# EasyEDA schematic PCB10.1_PRABHU.json
TITLE: Sheet_1; REV: 1.0; Date: 2021-05-30; Sheet: 1/1; Drawn By: Prabhu Sharma; Company: Your Company
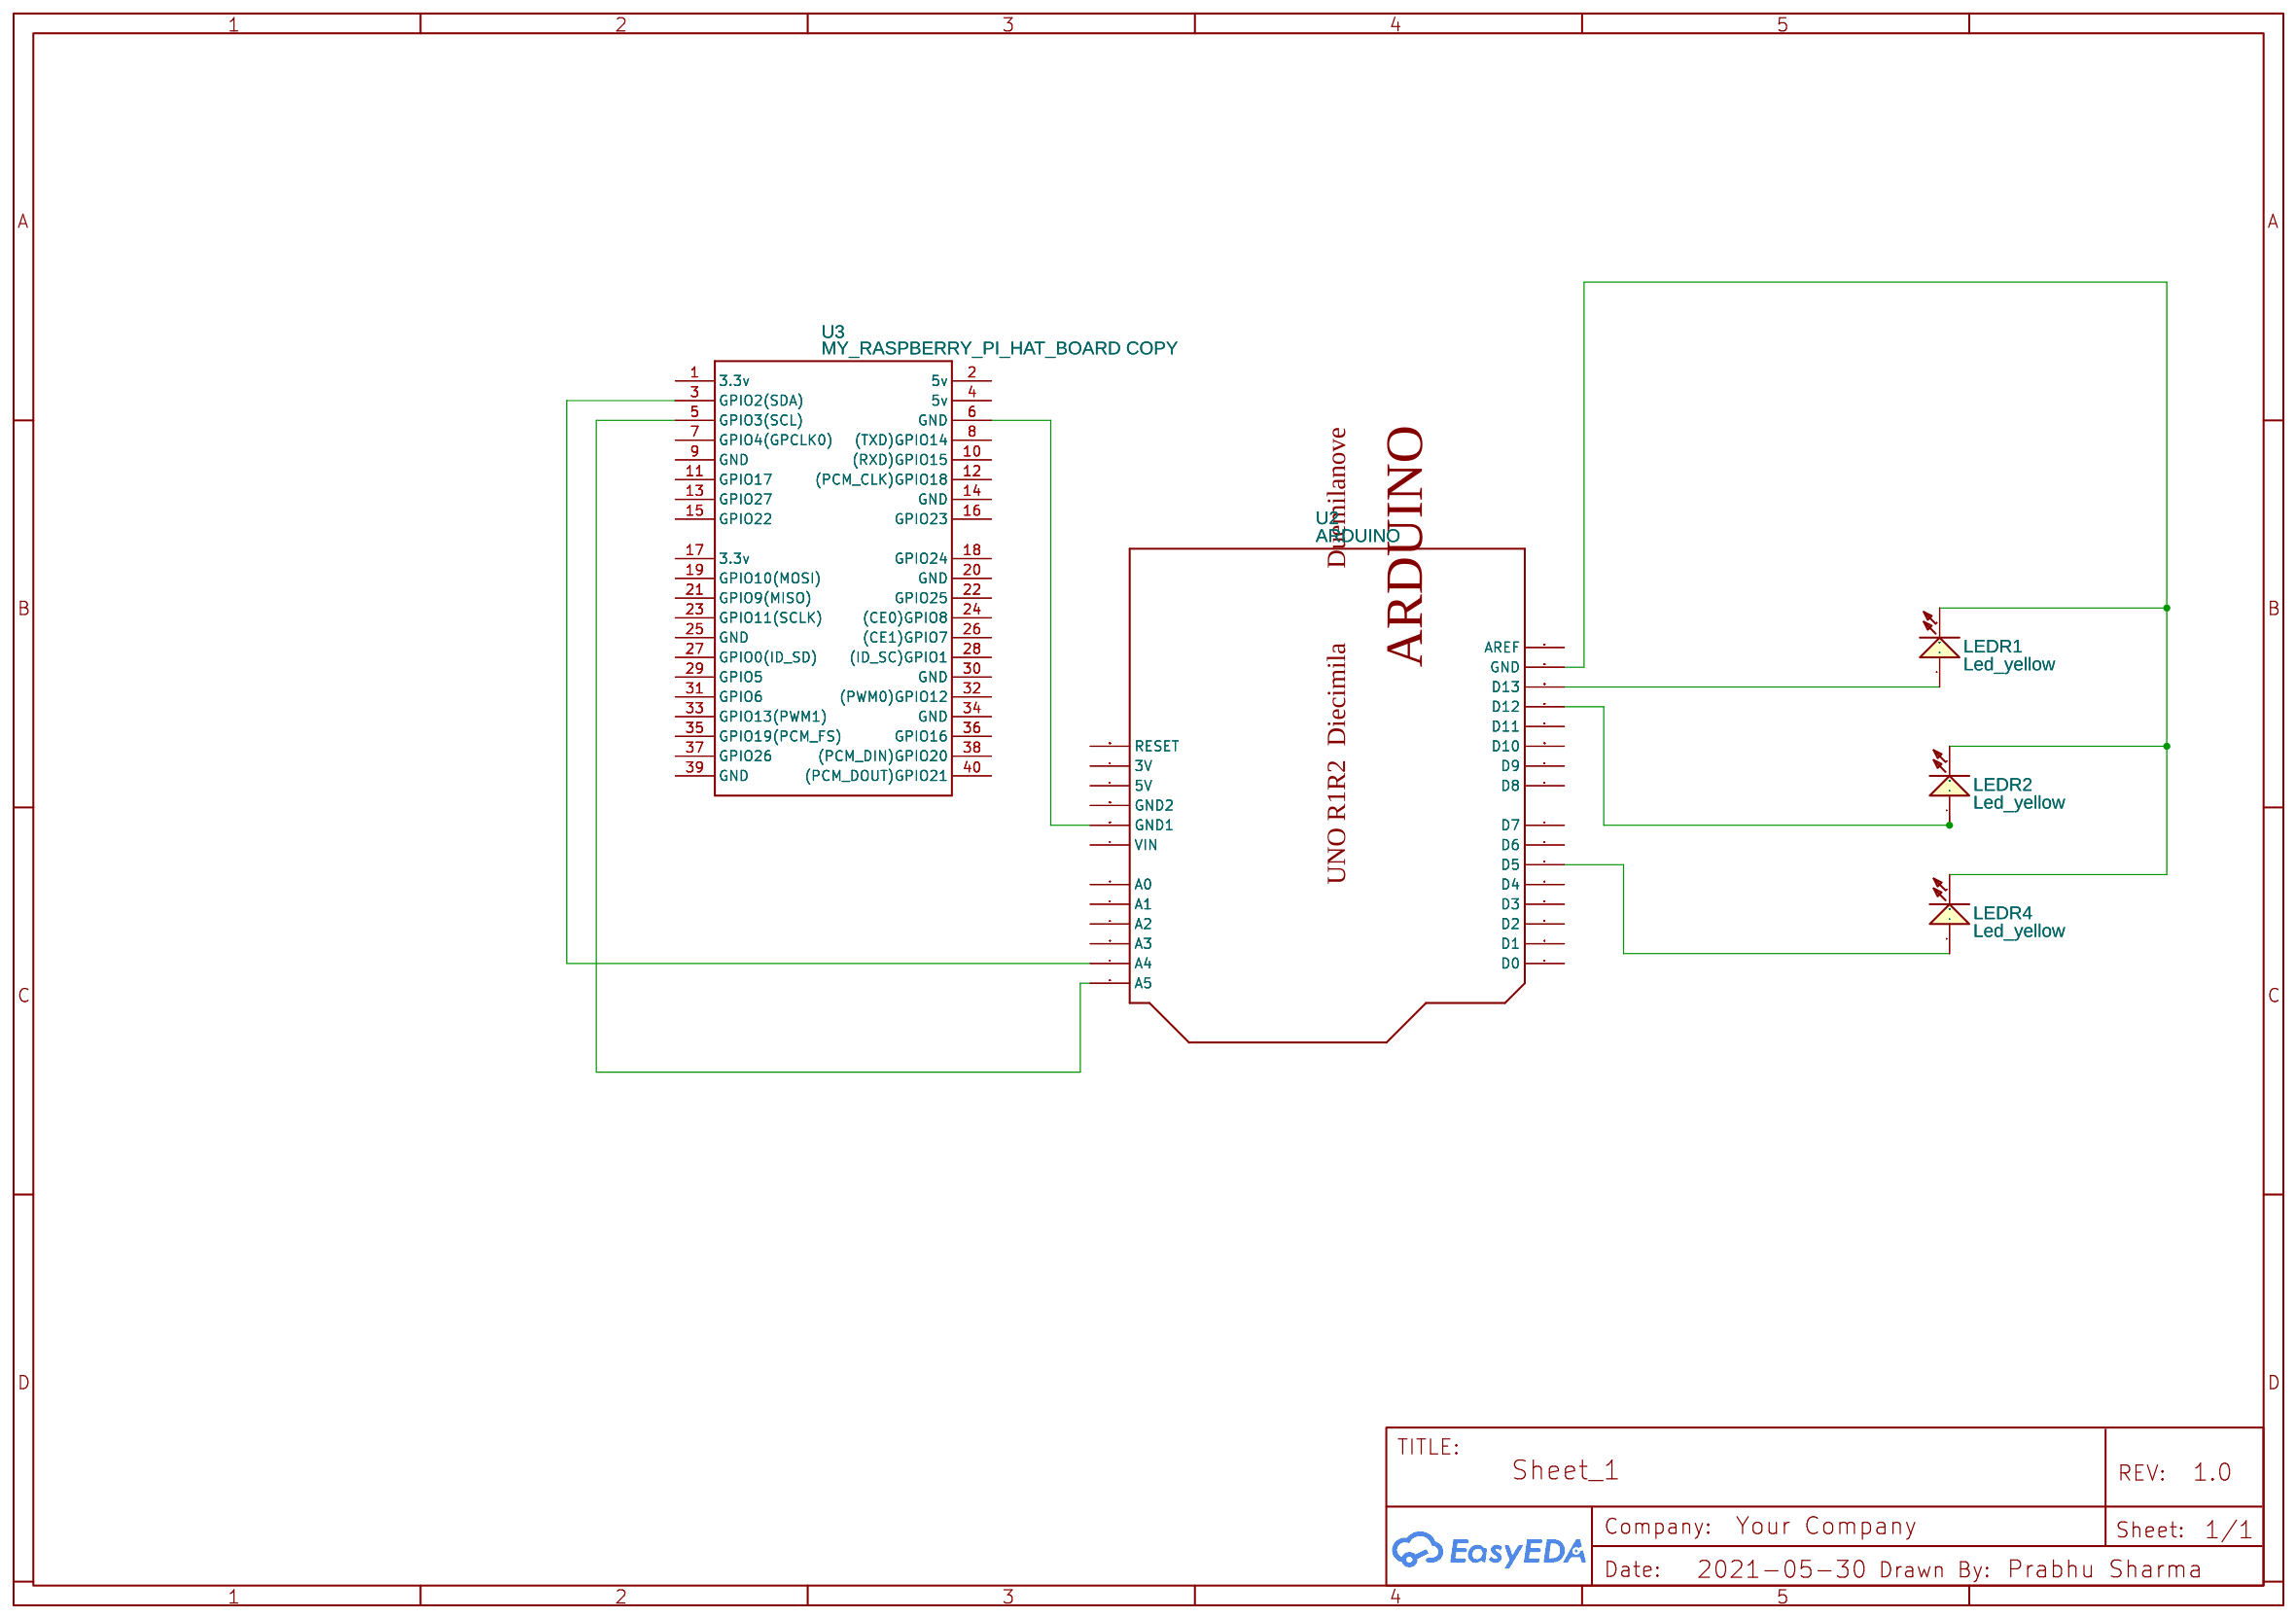
[diagram p0: schematic sheet]

## Parts
LEDR1  Led_yellow  [LED-5MM/2.54_ROJO]
LEDR2  Led_yellow  [LED-5MM/2.54_ROJO]
LEDR4  Led_yellow  [LED-5MM/2.54_ROJO]
U2  ARDUINO  [ARDUINO-BPLACE]
U3  MY_RASPBERRY_PI_HAT_BOARD COPY  [RASPBERRY_PI_3B_PLUS_HAT_BOARD]

## Library data of the parts
LEDR1 LEDR2 LEDR4 = Led_r: catid: 20; Contributor: Educaporale; sim: true
U2 = ARDUINO: Contributor: Gotfrid Müllner
U3 = MY_RASPBERRY_PI_HAT_BOARD COPY: catid: 20; Contributor: lwweb; Manufacturer Part: Raspberry-Pi-3B-Plus-HAT-Board; sim: true

## Nets
Net-(LEDR1-1): LEDR1.1(A) U2.D13
Net-(LEDR1-2): LEDR1.2(C) LEDR2.2(C) LEDR4.2(C) U2.GND
Net-(LEDR2-1): LEDR2.1(A) U2.D12
Net-(LEDR4-1): LEDR4.1(A) U2.D5
Net-(U2-A4): U2.A4 U3.3(GPIO2(SDA))
Net-(U2-A5): U2.A5 U3.5(GPIO3(SCL))
Net-(U2-GND1): U2.GND1 U3.6(GND)

Not connected (* = marked no-connect by the designer): U2 3V 5V A0 A1 A2 A3 AREF D0 D1 D2 D3 D4 D6 D7 D8 D9 D10 D11 GND2 RESET VIN; U3 1(3.3v) 2(5v) 4(5v) 7(GPIO4(GPCLK0)) 8((TXD)GPIO14) 9(GND) 10((RXD)GPIO15) 11(GPIO17) 12((PCM_CLK)GPIO18) 13(GPIO27) 14(GND) 15(GPIO22) 16(GPIO23) 17(3.3v) 18(GPIO24) 19(GPIO10(MOSI)) 20(GND) 21(GPIO9(MISO)) 22(GPIO25) 23(GPIO11(SCLK)) 24((CE0)GPIO8) 25(GND) 26((CE1)GPIO7) 27(GPIO0(ID_SD)) 28((ID_SC)GPIO1) 29(GPIO5) 30(GND) 31(GPIO6) 32((PWM0)GPIO12) 33(GPIO13(PWM1)) 34(GND) 35(GPIO19(PCM_FS)) 36(GPIO16) 37(GPIO26) 38((PCM_DIN)GPIO20) 39(GND) 40((PCM_DOUT)GPIO21)
